# Altium project RF_Attenuator.PrjPCB (part 1 of 2)
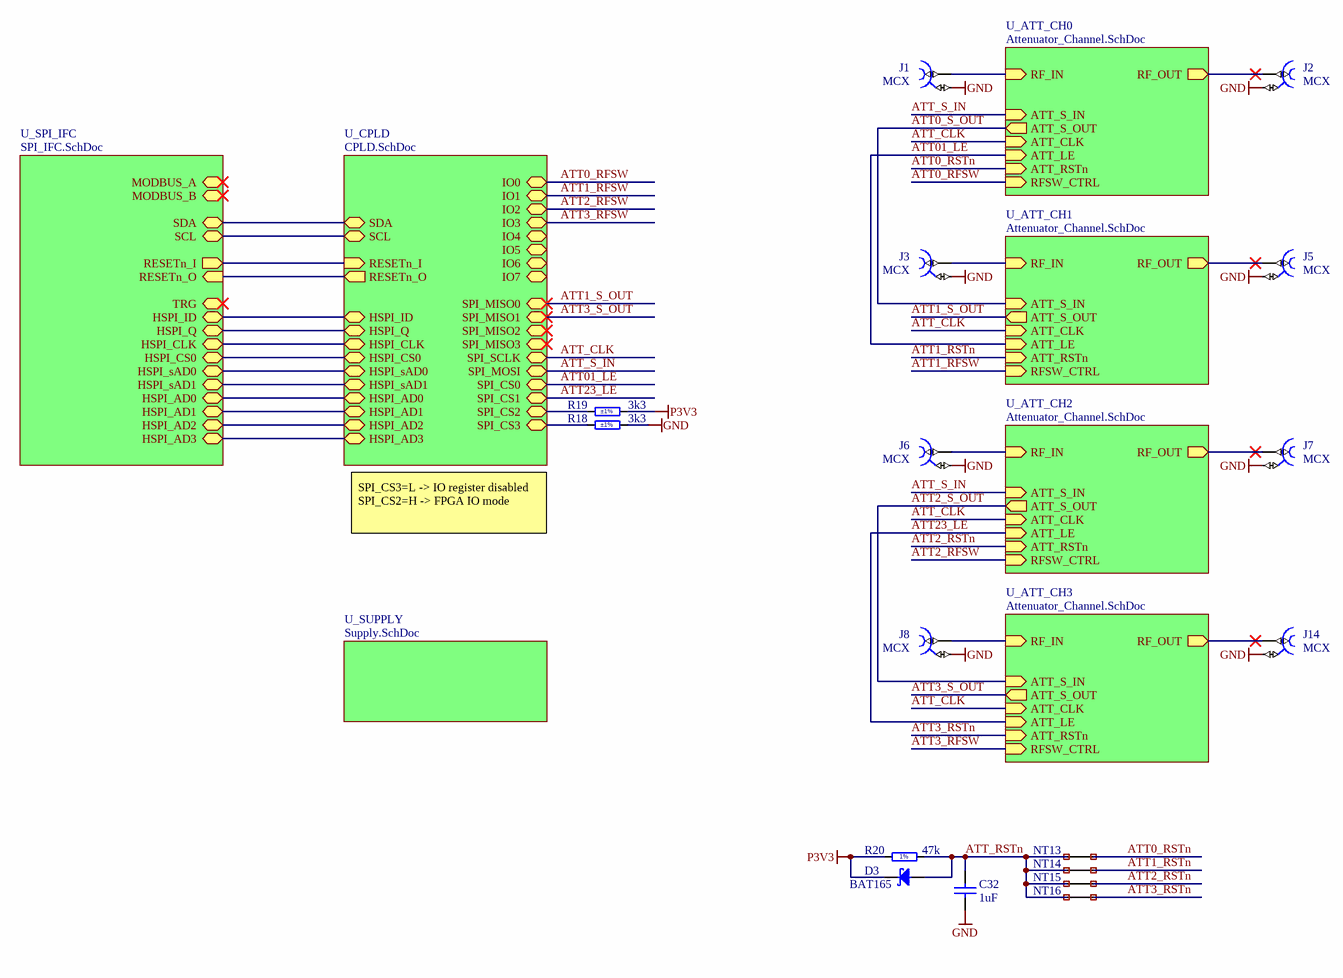
[diagram p0: RF_Attenuator.SchDoc]
ProjectRev: 1.0; ProjectName: RF Attenuator; Project: RF_attenuator_SW_4CH
5 sheets, 217 parts. Net scope: hierarchical (ports join the sheet entries above them; power ports are global).
Board file: RF_Attenuator.PCBDOC
Sheets:
  RF_Attenuator.SchDoc
    U_SPI_IFC = SPI_IFC.SchDoc
    U_ATT_CH0 = Attenuator_Channel.SchDoc
    U_ATT_CH1 = Attenuator_Channel.SchDoc
    U_ATT_CH2 = Attenuator_Channel.SchDoc
    U_ATT_CH3 = Attenuator_Channel.SchDoc
    U_SUPPLY = Supply.SchDoc
    U_CPLD = CPLD.SchDoc

## Sheet RF_Attenuator.SchDoc: =Project
size 420 x 297 mm; Author: G.Kasprowicz; CompanyName: WUT ISE; DrawnBy: G.Kasprowicz; Organization: WUT ISE; Address1: PW ISE; Address2: Nowowiejska 15/19 00-665 Warsaw; Address3: gkasprow@gmail.com; Revision: 1.0; SheetNumber: -; SheetTotal: -; ModifiedBy: -; CheckedDate: -; Title2: Top; DivGrp: WUT ISE; Designer: G.Kasprowicz; SPICEModelCacheRYPVXPCY: <root> / <DocumentId>RYPVXPCY</DocumentId> / </root>; ModifiedDate: -; ProjectName: Sensor Box

### Parts
C32  1uF  [CAPC1005X55N]
D3  BAT165  [SOD2512X110N]
J1  MCX  [AMPHENOL_919-109J-51PX]
J2  MCX  [AMPHENOL_919-109J-51PX]
J3  MCX  [AMPHENOL_919-109J-51PX]
J5  MCX  [AMPHENOL_919-109J-51PX]
J6  MCX  [AMPHENOL_919-109J-51PX]
J7  MCX  [AMPHENOL_919-109J-51PX]
J8  MCX  [AMPHENOL_919-109J-51PX]
J14  MCX  [AMPHENOL_919-109J-51PX]
NT13  Net Tie  [Net Tie 3]  (value not drawn)  (net tie, no BOM)
NT14  Net Tie  [Net Tie 3]  (value not drawn)  (net tie, no BOM)
NT15  Net Tie  [Net Tie 3]  (value not drawn)  (net tie, no BOM)
NT16  Net Tie  [Net Tie 3]  (value not drawn)  (net tie, no BOM)
R18  3k3  Tolerance: ±1%  [RESC1005X40N]
R19  3k3  Tolerance: ±1%  [RESC1005X40N]
R20  47k  [RESC1005X40N]

### Sub-sheets
U_ATT_CH0 = Attenuator_Channel.SchDoc: ATT_LE (in), RF_IN (in), RF_OUT (out), ATT_S_OUT (out), ATT_CLK (in), ATT_RSTn (in), ATT_S_IN (in), RFSW_CTRL (in)
U_ATT_CH1 = Attenuator_Channel.SchDoc: ATT_LE (in), RF_IN (in), RF_OUT (out), ATT_S_OUT (out), ATT_CLK (in), ATT_RSTn (in), ATT_S_IN (in), RFSW_CTRL (in)
U_ATT_CH2 = Attenuator_Channel.SchDoc: ATT_LE (in), RF_IN (in), RF_OUT (out), ATT_S_OUT (out), ATT_CLK (in), ATT_RSTn (in), ATT_S_IN (in), RFSW_CTRL (in)
U_ATT_CH3 = Attenuator_Channel.SchDoc: ATT_LE (in), RF_IN (in), RF_OUT (out), ATT_S_OUT (out), ATT_CLK (in), ATT_RSTn (in), ATT_S_IN (in), RFSW_CTRL (in)
U_CPLD = CPLD.SchDoc: SDA (bidir), SCL (bidir), RESETn_I (in), RESETn_O (out), HSPI_ID (bidir), HSPI_Q (bidir), HSPI_CLK (bidir), HSPI_CS0 (bidir), HSPI_sAD0 (bidir), HSPI_sAD1 (bidir), HSPI_AD0 (bidir), HSPI_AD1 (bidir), HSPI_AD2 (bidir), HSPI_AD3 (bidir), IO5 (bidir), IO0 (bidir), IO1 (bidir), SPI_MISO2 (bidir), SPI_CS3 (bidir), SPI_CS1 (bidir), SPI_SCLK (bidir), IO4 (bidir), SPI_MISO3 (bidir), IO3 (bidir), SPI_MISO0 (bidir), SPI_CS0 (bidir), SPI_MOSI (bidir), SPI_CS2 (bidir), IO2 (bidir), IO7 (bidir), SPI_MISO1 (bidir), IO6 (bidir)
U_SPI_IFC = SPI_IFC.SchDoc: TRG (bidir), SCL (bidir), RESETn_O (in), MODBUS_A (bidir), HSPI_AD3 (bidir), MODBUS_B (bidir), RESETn_I (out), SDA (bidir), HSPI_CLK (bidir), HSPI_Q (bidir), HSPI_sAD0 (bidir), HSPI_ID (bidir), HSPI_AD2 (bidir), HSPI_CS0 (bidir), HSPI_AD1 (bidir), HSPI_sAD1 (bidir), HSPI_AD0 (bidir)
U_SUPPLY = Supply.SchDoc: no entries

### Nets
GND: C32.1 J1.2 J2.2 J3.2 J5.2 J6.2 J7.2 J8.2 J14.2 R18.2
P3V3: D3.1(C) R19.2 R20.1
ATT0_RFSW: sheet U_ATT_CH0/RFSW_CTRL, sheet U_CPLD/IO0
ATT0_RSTn: NT13.2 ; sheet U_ATT_CH0/ATT_RSTn
ATT0_S_OUT: sheet U_ATT_CH0/ATT_S_OUT, sheet U_ATT_CH1/ATT_S_IN
ATT01_LE: sheet U_ATT_CH0/ATT_LE, sheet U_ATT_CH1/ATT_LE, sheet U_CPLD/SPI_CS0
ATT1_RFSW: sheet U_ATT_CH1/RFSW_CTRL, sheet U_CPLD/IO1
ATT1_RSTn: NT14.2 ; sheet U_ATT_CH1/ATT_RSTn
ATT1_S_OUT: sheet U_ATT_CH1/ATT_S_OUT, sheet U_CPLD/SPI_MISO0
ATT2_RFSW: sheet U_ATT_CH2/RFSW_CTRL, sheet U_CPLD/IO2
ATT2_RSTn: NT15.2 ; sheet U_ATT_CH2/ATT_RSTn
ATT2_S_OUT: sheet U_ATT_CH2/ATT_S_OUT, sheet U_ATT_CH3/ATT_S_IN
ATT3_RFSW: sheet U_ATT_CH3/RFSW_CTRL, sheet U_CPLD/IO3
ATT3_RSTn: NT16.2 ; sheet U_ATT_CH3/ATT_RSTn
ATT3_S_OUT: sheet U_ATT_CH3/ATT_S_OUT, sheet U_CPLD/SPI_MISO1
ATT23_LE: sheet U_ATT_CH2/ATT_LE, sheet U_ATT_CH3/ATT_LE, sheet U_CPLD/SPI_CS1
ATT_CLK: sheet U_ATT_CH0/ATT_CLK, sheet U_ATT_CH1/ATT_CLK, sheet U_ATT_CH2/ATT_CLK, sheet U_ATT_CH3/ATT_CLK, sheet U_CPLD/SPI_SCLK
ATT_RSTn: C32.2 D3.2(A) NT13.1 NT14.1 NT15.1 NT16.1 R20.2
ATT_S_IN: sheet U_ATT_CH0/ATT_S_IN, sheet U_ATT_CH2/ATT_S_IN, sheet U_CPLD/SPI_MOSI
HSPI_AD0: sheet U_SPI_IFC/HSPI_AD0, sheet U_CPLD/HSPI_AD0
HSPI_AD1: sheet U_SPI_IFC/HSPI_AD1, sheet U_CPLD/HSPI_AD1
HSPI_AD2: sheet U_SPI_IFC/HSPI_AD2, sheet U_CPLD/HSPI_AD2
HSPI_AD3: sheet U_SPI_IFC/HSPI_AD3, sheet U_CPLD/HSPI_AD3
HSPI_CLK: sheet U_SPI_IFC/HSPI_CLK, sheet U_CPLD/HSPI_CLK
HSPI_CS0: sheet U_SPI_IFC/HSPI_CS0, sheet U_CPLD/HSPI_CS0
HSPI_ID: sheet U_SPI_IFC/HSPI_ID, sheet U_CPLD/HSPI_ID
HSPI_Q: sheet U_SPI_IFC/HSPI_Q, sheet U_CPLD/HSPI_Q
HSPI_sAD0: sheet U_SPI_IFC/HSPI_sAD0, sheet U_CPLD/HSPI_sAD0
HSPI_sAD1: sheet U_SPI_IFC/HSPI_sAD1, sheet U_CPLD/HSPI_sAD1
RESETn_I: sheet U_SPI_IFC/RESETn_I, sheet U_CPLD/RESETn_I
RESETn_O: sheet U_SPI_IFC/RESETn_O, sheet U_CPLD/RESETn_O
SCL: sheet U_SPI_IFC/SCL, sheet U_CPLD/SCL
SDA: sheet U_SPI_IFC/SDA, sheet U_CPLD/SDA
SPI_CS2: R19.1 ; sheet U_CPLD/SPI_CS2
SPI_CS3: R18.1 ; sheet U_CPLD/SPI_CS3
NetC5A_2: J1.1 ; sheet U_ATT_CH0/RF_IN
NetC5B_2: J3.1 ; sheet U_ATT_CH1/RF_IN
NetC5C_2: J6.1 ; sheet U_ATT_CH2/RF_IN
NetC5D_2: J8.1 ; sheet U_ATT_CH3/RF_IN
NetD2A_2: J2.1 ; sheet U_ATT_CH0/RF_OUT
NetD2B_2: J5.1 ; sheet U_ATT_CH1/RF_OUT
NetD2C_2: J7.1 ; sheet U_ATT_CH2/RF_OUT
NetD2D_2: J14.1 ; sheet U_ATT_CH3/RF_OUT

### Notes on the sheet
- SPI_CS3=L -> IO register disabled
  SPI_CS2=H -> FPGA IO mode
- Project/Equipment
- Document
- Designer
- Drawn by
- Check.by
- Copyright WUT ISE 2018.
  This documentation describes Open Hardware and is licensed under the CERN OHL v.1.1. You may redistribute and modify this documentation under the terms of the CERN OHL v.1.1. (http://ohwr.org/CERNOHL). This documentation is distributed WITHOUT ANY EXPRESS OR IMPLIED WARRANTY, INCLUDING OF MERCHANTABILITY, SATISFACTORY QUALITY AND FITNESS FOR A PARTICULAR PURPOSE. Please see the CERN OHL v.1.1 for applicable conditions.
- Contact
- File
- Last Mod.
- Print Date
- Sheet
- Size
- A3
- of
- Rev
- (in symbol R0402_47K_1%_0.0625W_100PPM) 1%

### Library data of the parts
C32 = CC0402_1UF_16V_10%_X5R: Non-polarised capacitor; Part Description: SMD Multilayer Chip Ceramic Capacitor; Manufacturer: GENERIC; Manufacturer1 Part Number: C1005X5R1C105KT; Voltage: 16V; TC: X5R; Tolerance: ±10%; Part Number: CC0402_1UF_16V_10%_X5R; Component Kind: Standard; Component Type: Standard; Pin Count: 2; Value: 1uF; Status: Preferred; Manufacturer Part Number: CC0402_1UF_16V_10%_X5R; Case: 0402; Mounted: Yes; Socket: No; SMD: Yes; Sense: No; Manufacturer1 Example: TDK; Manufacturer1 ComponentHeight: 0.55mm; HelpURL: \\cern.ch\dfs\Applications\Altium\Datasheets\CC0402_X5R_TDK_C.pdf; Author: CERN DEM JLC; CreateDate: 25.10.2012; LatestRevisionDate: 25.10.2012
D3 = BAT165: Schottky Diode; Part Description: Medium Power AF Schottky Diode; Manufacturer: INFINEON; Voltage: 40V; Power: 750mA; PressFit: No; Bonding: No; Part Number: BAT165; Component Kind: Standard; Component Type: Standard; Device: BAT165; PackageDescription: Small Outline Diode (SOD-323), 1.70mm W X 1.25mm L X 1.10mm H body,  IPC Medium Density; Manufacturer Part Number: BAT165; Pin Count: 2; Case: SOD-323; Mounted: Yes; Socket: No; SMD: Yes; Sense: No; ComponentHeight: 1.1mm; HelpURL: \\cern.ch\dfs\Applications\Altium\Datasheets\BAT165.pdf; Author: CERN DEM JLC; CreateDate: 12.11.2014; LatestRevisionDate: 12.11.2014
J1-J3 J5-J8 J14 = AMPHENOL_919-109J-51PX: Part Description: 50 Ohms, RF Connector, MCX Straight PCB Receptacle Jack; Manufacturer Part Number: 919-109J-51PX (MCX6251B1-3GT30G-50); PressFit: No; Part Number: AMPHENOL_919-109J-51PX; Component Kind: Standard; Component Type: Standard; Pin Count: 5; Family: MCX; Mounted: Yes; Socket: No; SMD: No; Sense: No; Status: None; Manufacturer: AMPHENOL; ComponentHeight: 6.06mm; HelpURL: \\cern.ch\dfs\Applications\Altium\Datasheets\AMPHENOL_919-109J-51PX.pdf; Author: CERN DEM BC; CreateDate: 31.01.2019; LatestRevisionDate: 31.01.2019
NT13-NT16 = Net Tie 3: Part Description: Net Tie (2 Nets); Mounted: No; Part Number: Net Tie 3; Component Type: Net Tie; Pin Count: 2; Family: Net Tie; Socket: No; SMD: No; Sense: No; Status: None; ComponentHeight: 0mm; HelpURL: Undefined; Author: CERN DEM HF; CreateDate: 23.09.2024; LatestRevisionDate: 23.09.2024; PackageDescription: SMD Net Tie
R18 R19 = R0402_3K3_1%_0.0625W_100PPM: Resistor - 1%; Part Description: General Purpose Thick Film Chip Resistor; Manufacturer: GENERIC; Manufacturer1 Part Number: 232270673302L; TC: ±100ppm/°C; PressFit: No; Part Number: R0402_3K3_1%_0.0625W_100PPM; Component Kind: Standard; Component Type: Standard; Pin Count: 2; Value: 3k3; Status: Not Recommended; Power: 0.0625W; Manufacturer Part Number: R0402_3K3_1%_0.0625W_100PPM; Case: 0402; Mounted: Yes; Sense: No; Socket: No; SMD: Yes; Manufacturer1 Example: YAGEO PHYCOMP; Manufacturer1 ComponentHeight: 0.4mm; HelpURL: \\cern.ch\dfs\Applications\Altium\Datasheets\R0402_Phycomp_RC0402.pdf; Author: CERN DEM JLC; CreateDate: 03.12.2007; LatestRevisionDate: 17.10.2012
R20 = R0402_47K_1%_0.0625W_100PPM: Resistor - 1%; Part Description: General Purpose Thick Film Chip Resistor; Manufacturer: GENERIC; Manufacturer1 Part Number: 232270675103L; TC: ±100ppm/°C; PressFit: No; Part Number: R0402_47K_1%_0.0625W_100PPM; Component Kind: Standard; Component Type: Standard; Pin Count: 2; Value: 47k; Status: Not Recommended; Power: 0.0625W; Tolerance: ±1%; Manufacturer Part Number: R0402_47K_1%_0.0625W_100PPM; Case: 0402; Mounted: Yes; Sense: No; Socket: No; SMD: Yes; Manufacturer1 Example: YAGEO PHYCOMP; Manufacturer1 ComponentHeight: 0.4mm; HelpURL: \\cern.ch\dfs\Applications\Altium\Datasheets\R0402_Phycomp_RC0402.pdf; Author: CERN DEM JLC; CreateDate: 03/12/2007; LatestRevisionDate: 17/10/2012

## Sheet SPI_IFC.SchDoc: =Project
size 420 x 297 mm; Author: G.Kasprowicz; CompanyName: WUT ISE; DrawnBy: G.Kasprowicz; Organization: WUT ISE; Address1: PW ISE; Address2: Nowowiejska 15/19 00-665 Warsaw; Address3: gkasprow@gmail.com; Revision: 1.0; SheetNumber: -; SheetTotal: -; ModifiedBy: -; CheckedDate: -; Title2: SPI IFC; DivGrp: WUT ISE; Designer: G.Kasprowicz; SPICEModelCacheRYPVXPCY: <root> / <DocumentId>RYPVXPCY</DocumentId> / </root>; ModifiedDate: -; ProjectName: Sensor Box
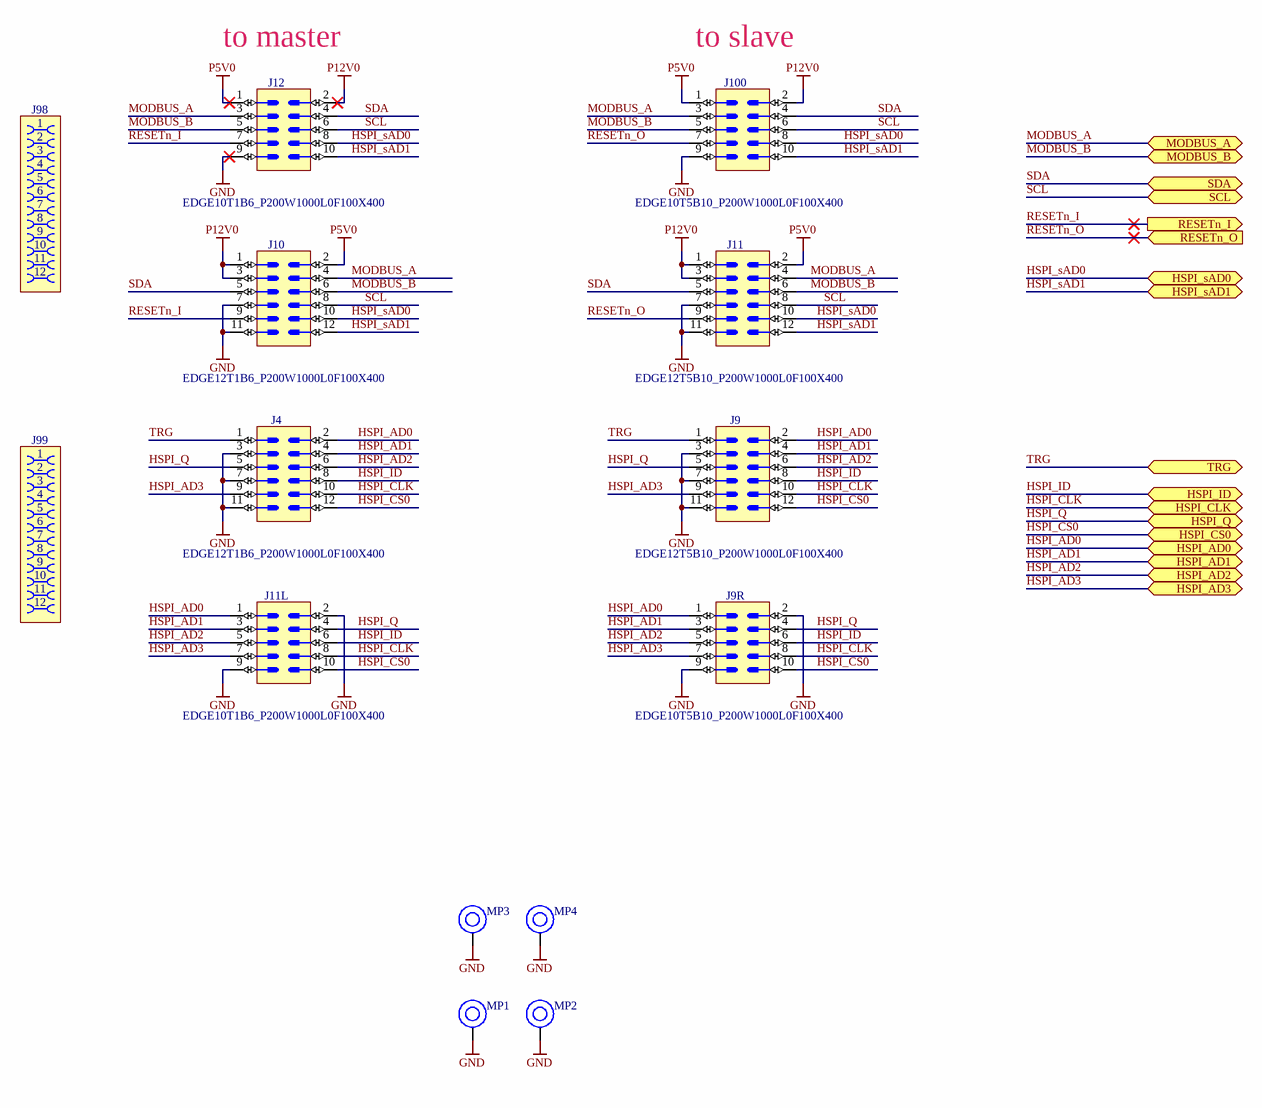
[diagram p1: SPI_IFC.SchDoc]

### Parts
J4  (no value)  [EDGE12T1B6_P200W1000L0F100X400]
J9  (no value)  [EDGE12T5B10_P200W1000L0F100X400]
J9R  (no value)  [EDGE10T5B10_P200W1000L0F100X400]
J10  (no value)  [EDGE12T1B6_P200W1000L0F100X400]
J11  (no value)  [EDGE12T5B10_P200W1000L0F100X400]
J11L  (no value)  [EDGE10T1B6_P200W1000L0F100X400]
J12  (no value)  [EDGE10T1B6_P200W1000L0F100X400]
J98  (no value)  [AVX_009159012761916]
J99  (no value)  [AVX_009159012761916]
J100  (no value)  [EDGE10T5B10_P200W1000L0F100X400]
MP1  M1.6 x 3mm  [97730306330]  (value not drawn)
MP2  M1.6 x 3mm  [97730306330]  (value not drawn)
MP3  M1.6 x 3mm  [97730306330]  (value not drawn)
MP4  M1.6 x 3mm  [97730306330]  (value not drawn)

### Ports
HSPI_AD0 (bidir), HSPI_AD1 (bidir), HSPI_AD2 (bidir), HSPI_AD3 (bidir), HSPI_CLK (bidir), HSPI_CS0 (bidir), HSPI_ID (bidir), HSPI_Q (bidir), HSPI_sAD0 (bidir), HSPI_sAD1 (bidir), MODBUS_A (bidir), MODBUS_B (bidir), RESETn_I (out), RESETn_O (in), SCL (bidir), SDA (bidir), TRG (bidir)

### Nets
GND: J4.3 J4.7 J4.11 J9.3 J9.7 J9.11 J9R.2 J9R.9 J10.7 J10.11 J11.7 J11.11 J11L.2 J11L.9 J12.9 J100.9 MP1.1 MP2.1 MP3.1 MP4.1
P5V0: J10.2 J11.2 J12.1 J100.1
P12V0: J10.1 J10.3 J11.1 J11.3 J12.2 J100.2
HSPI_AD0: J4.2 J9.2 J9R.1 J11L.1 ; port HSPI_AD0
HSPI_AD1: J4.4 J9.4 J9R.3 J11L.3 ; port HSPI_AD1
HSPI_AD2: J4.6 J9.6 J9R.5 J11L.5 ; port HSPI_AD2
HSPI_AD3: J4.9 J9.9 J9R.7 J11L.7 ; port HSPI_AD3
HSPI_CLK: J4.10 J9.10 J9R.8 J11L.8 ; port HSPI_CLK
HSPI_CS0: J4.12 J9.12 J9R.10 J11L.10 ; port HSPI_CS0
HSPI_ID: J4.8 J9.8 J9R.6 J11L.6 ; port HSPI_ID
HSPI_Q: J4.5 J9.5 J9R.4 J11L.4 ; port HSPI_Q
HSPI_sAD0: J10.10 J11.10 J12.8 J100.8 ; port HSPI_sAD0
HSPI_sAD1: J10.12 J11.12 J12.10 J100.10 ; port HSPI_sAD1
MODBUS_A: J10.4 J11.4 J12.3 J100.3 ; port MODBUS_A
MODBUS_B: J10.6 J11.6 J12.5 J100.5 ; port MODBUS_B
RESETn_I: J10.9 J12.7 ; port RESETn_I
RESETn_O: J11.9 J100.7 ; port RESETn_O
SCL: J10.8 J11.8 J12.6 J100.6 ; port SCL
SDA: J10.5 J11.5 J12.4 J100.4 ; port SDA
TRG: J4.1 J9.1 ; port TRG

### Notes on the sheet
- (near J12) to master
- (near J100) to slave
- Project/Equipment
- Document
- Designer
- Drawn by
- Check.by
- Copyright WUT ISE 2018.
  This documentation describes Open Hardware and is licensed under the CERN OHL v.1.1. You may redistribute and modify this documentation under the terms of the CERN OHL v.1.1. (http://ohwr.org/CERNOHL). This documentation is distributed WITHOUT ANY EXPRESS OR IMPLIED WARRANTY, INCLUDING OF MERCHANTABILITY, SATISFACTORY QUALITY AND FITNESS FOR A PARTICULAR PURPOSE. Please see the CERN OHL v.1.1 for applicable conditions.
- Contact
- File
- Last Mod.
- Print Date
- Sheet
- Size
- A3
- of
- Rev
- (in symbol AVX_009159012761916) 11

### Library data of the parts
J4 J10 = PCB Edge Connector 12 (2x6): Part Number: EDGE10T1B6_P200W1000L0F100X400; Part Description: 10 Contacts Board Edge Connector, Pitch 2mm, Length 0mm, Width 10mm, Finger Lenght 4mm, Finger Width 1mm; Mounted: No; PressFit: No; Component Kind: Standard (No BOM); Component Type: Standard (No BOM); Pin Count: 12; Socket: No; SMD: No; Sense: No; Status: None; ComponentHeight: 0mm; HelpURL: \\cern.ch\dfs\Applications\Altium\Datasheets\EDGE10T1B6_P200W1000L0F100X400.pdf; Author: CERN DEM MR; CreateDate: 14.02.2018; LatestRevisionDate: 14.02.2018
J9 J11 = PCB Edge Connector 12 (2x6) R: PCB Edge Connector 12 (2x6); Part Description: 12 Contacts Board Edge Connector, Pitch 2mm, Length 0mm, Width 10mm, Finger Lenght 4mm, Finger Width 1mm; Mounted: No; PressFit: No; Part Number: EDGE12T5B10_P200W1000L0F100X400; Component Kind: Standard (No BOM); Component Type: Standard (No BOM); Pin Count: 12; Socket: No; SMD: No; Sense: No; Status: None; ComponentHeight: 0mm; HelpURL: \\cern.ch\dfs\Applications\Altium\Datasheets\EDGE10T5B10_P200W1000L0F100X400.pdf; Author: GK; CreateDate: 14.02.2018; LatestRevisionDate: 14.02.2018
J9R J100 = EDGE10T5B10_P200W1000L0F100X400: PCB Edge Connector 10 (2x5); Part Description: 10 Contacts Board Edge Connector, Pitch 2mm, Length 0mm, Width 10mm, Finger Lenght 4mm, Finger Width 1mm; Mounted: No; PressFit: No; Part Number: EDGE10T5B10_P200W1000L0F100X400; Component Kind: Standard (No BOM); Component Type: Standard (No BOM); Pin Count: 10; Socket: No; SMD: No; Sense: No; Status: None; ComponentHeight: 0mm; HelpURL: \\cern.ch\dfs\Applications\Altium\Datasheets\EDGE10T5B10_P200W1000L0F100X400.pdf; Author: CERN DEM MR; CreateDate: 14.02.2018; LatestRevisionDate: 14.02.2018
J11L J12 = EDGE10T1B6_P200W1000L0F100X400: PCB Edge Connector 10 (2x5); Part Description: 10 Contacts Board Edge Connector, Pitch 2mm, Length 0mm, Width 10mm, Finger Lenght 4mm, Finger Width 1mm; Mounted: No; PressFit: No; Part Number: EDGE10T1B6_P200W1000L0F100X400; Component Kind: Standard (No BOM); Component Type: Standard (No BOM); Pin Count: 10; Socket: No; SMD: No; Sense: No; Status: None; ComponentHeight: 0mm; HelpURL: \\cern.ch\dfs\Applications\Altium\Datasheets\EDGE10T1B6_P200W1000L0F100X400.pdf; Author: CERN DEM MR; CreateDate: 14.02.2018; LatestRevisionDate: 14.02.2018
J98 J99 = AVX_009159012761916: Open Ended Card Edge Connector, 9159 Series; Part Number: AVX_0009159012761916; Part Description: 10 Contacts, 2mm Pitch, Open Ended Card Edge Connector, 9159 Series; Manufacturer: AVX; PressFit: No; Component Kind: Standard; Component Type: Standard; Pin Count: 12; Mounted: Yes; Socket: No; SMD: No; Sense: No; Status: None; Manufacturer Part Number: 009159012761916; ComponentHeight: 1.6mm; HelpURL: \\cern.ch\dfs\Applications\Altium\Datasheets\AVX_00 9159 010 061 916.pdf; Author: GK; CreateDate: 13.02.2018; LatestRevisionDate: 13.02.2018
MP1-MP4 = 97730306330R: WA-SMSI SMT Steel Spacer with internal Thread Bottom closed, OD 3.3mm, M1.6 x 3mm; Manufacturer: Wurth Elektronik; Inside Thread Length: 1.8mm; Surface: Tin; ComponentLink1Description: Website Link; ComponentLink1URL: https://www.we-online.com/redexpert/article/97730306330R?ad; ComponentLink2Description: Datasheet Link; ComponentLink2URL: https://www.we-online.com/redexpert/spec/97730306330R?ad; Manufacturer Part Number: 97730306330R; Category: SMT Spacers; Match Code: WA-SMSI; Mount: Surface Mount; Operating Temperature Max: 150°C; Operating Temperature Min: -55°C; Packaging: Tape and Reel; Height: 3mm; Material: Steel; Outside Diameter: 3.3mm; Thread Size: M1.6

## Sheet Attenuator_Channel.SchDoc: =Project
size 420 x 297 mm; Author: G.Kasprowicz; CompanyName: WUT ISE; DrawnBy: G.Kasprowicz; Organization: WUT ISE; Address1: PW ISE; Address2: Nowowiejska 15/19 00-665 Warsaw; Address3: gkasprow@gmail.com; Revision: 1.0; SheetNumber: -; SheetTotal: -; ModifiedBy: -; CheckedDate: -; Title2: Attenuator Channel; DivGrp: WUT ISE; Designer: G.Kasprowicz; SPICEModelCacheRYPVXPCY: <root> / <DocumentId>RYPVXPCY</DocumentId> / </root>; ModifiedDate: -; ProjectName: Sensor Box
Used 4 times, as channels U_ATT_CH0, U_ATT_CH1, U_ATT_CH2, U_ATT_CH3. Parts and nets are listed once, with the designators drawn on the sheet.
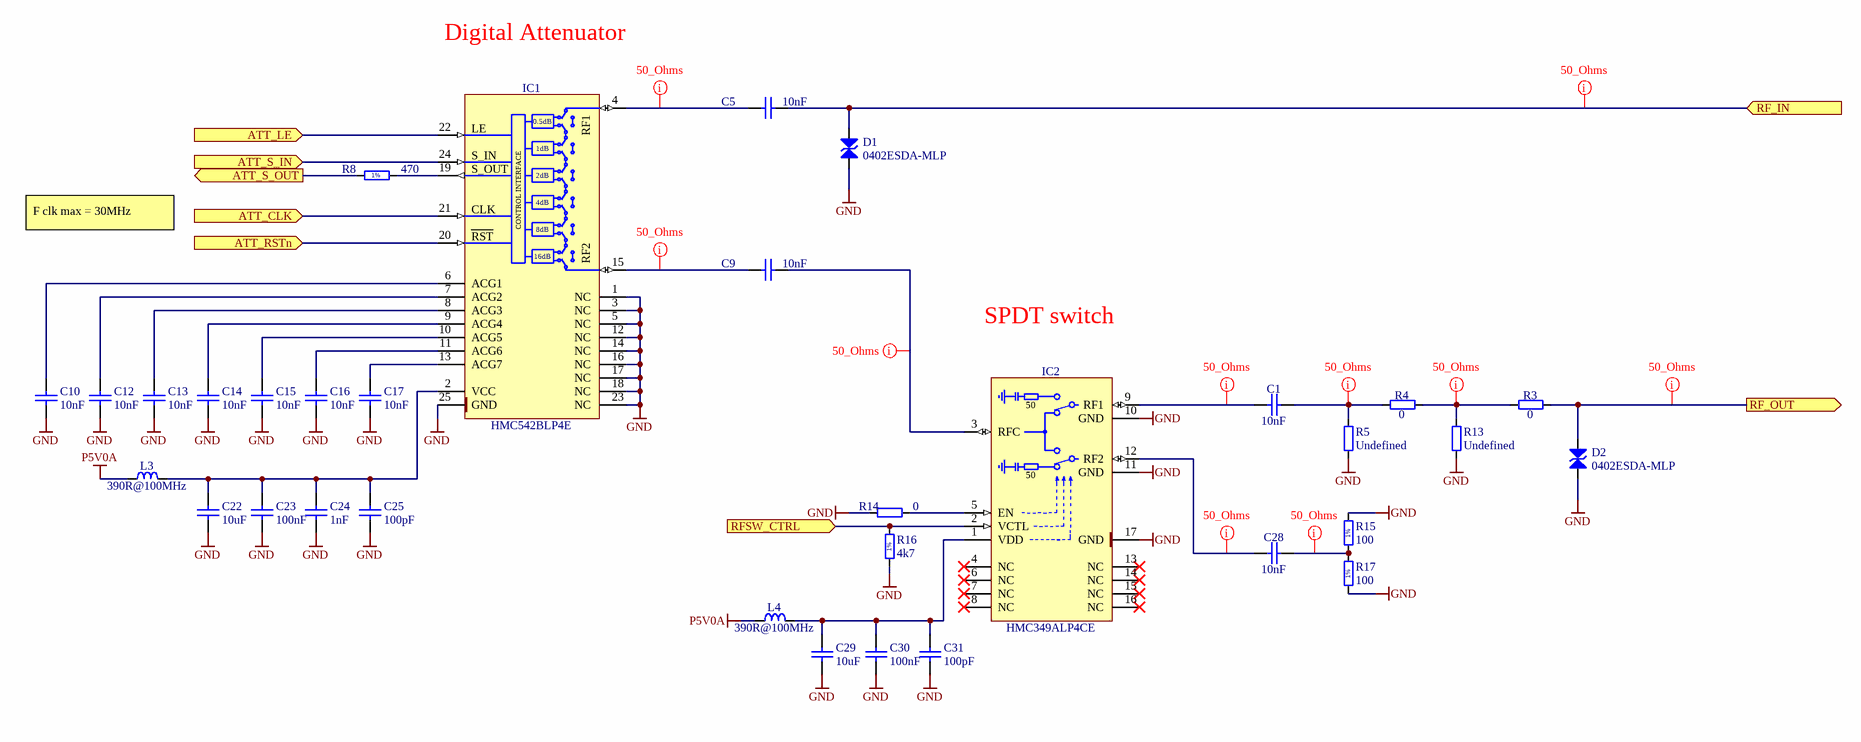
[diagram p2: Attenuator_Channel.SchDoc]

### Parts
C1  10nF  [CAPC1005X55N]
C5  10nF  [CAPC1005X55N]
C9  10nF  [CAPC1005X55N]
C10  10nF  [CAPC1005X55N]
C12  10nF  [CAPC1005X55N]
C13  10nF  [CAPC1005X55N]
C14  10nF  [CAPC1005X55N]
C15  10nF  [CAPC1005X55N]
C16  10nF  [CAPC1005X55N]
C17  10nF  [CAPC1005X55N]
C22  10uF  [CAPC1608X80N]
C23  100nF  [CAPC1005X55N]
C24  1nF  [CAPC1005X55N]
C25  100pF  [CAPC1005X55N]
C28  10nF  [CAPC1005X55N]
C29  10uF  [CAPC1608X80N]
C30  100nF  [CAPC1005X55N]
C31  100pF  [CAPC1005X55N]
D1  0402ESDA-MLP  [EATON_0402ESDA-MLP]
D2  0402ESDA-MLP  [EATON_0402ESDA-MLP]
IC1  HMC542BLP4E  [QFN50P400X400X100-25N-S295]
IC2  HMC349ALP4CE  [QFN65P400X400X100-17N-S255]
L3  390R@100MHz  [INDC1608X95N]
L4  390R@100MHz  [INDC1608X95N]
R3  0  [RESC1005X40N]
R4  0  [RESC1005X40N]
R5  Undefined  [RESC1005X40N]
R8  470  [RESC1005X40N]
R13  Undefined  [RESC1005X40N]
R14  0  [RESC1005X40N]
R15  100  [RESC1005X40N]
R16  4k7  [RESC1005X40N]
R17  100  [RESC1005X40N]

### Ports
ATT_CLK (in), ATT_LE (in), ATT_RSTn (in), ATT_S_IN (in), ATT_S_OUT (out), RF_IN (in), RF_OUT (out), RFSW_CTRL (in)

### Nets
GND: C10.1 C12.1 C13.1 C14.1 C15.1 C16.1 C17.1 C22.1 C23.1 C24.1 C25.1 C29.1 C30.1 C31.1 D1.1 D2.1 IC1.1(NC) IC1.3(NC) IC1.5(NC) IC1.12(NC) IC1.14(NC) IC1.16(NC) IC1.17(NC) IC1.18(NC) IC1.23(NC) IC1.25(GND) IC2.10(GND) IC2.11(GND) IC2.17(GND) R5.1 R13.1 R14.1 R15.2 R16.1 R17.1
P5V0A: L3.1 L4.1
ATT_CLK: IC1.21(SHIFT_CLOCK) ; port ATT_CLK
ATT_LE: IC1.22(LATCH_ENABLE) ; port ATT_LE
ATT_RSTn: IC1.20(~{RESET}) ; port ATT_RSTn
ATT_S_IN: IC1.24(SERIAL_INPUT) ; port ATT_S_IN
ATT_S_OUT: R8.1 ; port ATT_S_OUT
RF_IN: C5.2 D1.2 ; port RF_IN
RF_OUT: D2.2 R3.2 ; port RF_OUT
RFSW_CTRL: IC2.2(VCTL) R16.2 ; port RFSW_CTRL
NetC1_1: C1.1 IC2.9(RF1)
NetC1_2: C1.2 R4.1 R5.2
NetC5_1: C5.1 IC1.4(RF1)
NetC9_1: C9.1 IC1.15(RF2)
NetC9_2: C9.2 IC2.3(RFC)
NetC10_2: C10.2 IC1.6(ACG1)
NetC12_2: C12.2 IC1.7(ACG2)
NetC13_2: C13.2 IC1.8(ACG3)
NetC14_2: C14.2 IC1.9(ACG4)
NetC15_2: C15.2 IC1.10(ACG5)
NetC16_2: C16.2 IC1.11(ACG6)
NetC17_2: C17.2 IC1.13(ACG7)
NetC22_2: C22.2 C23.2 C24.2 C25.2 IC1.2(VCC) L3.2
NetC28_1: C28.1 IC2.12(RF2)
NetC28_2: C28.2 R15.1 R17.2
NetC29_2: C29.2 C30.2 C31.2 IC2.1(VDD) L4.2
NetIC1_19: IC1.19(SERIAL_OUTPUT) R8.2
NetIC2_5: IC2.5(EN) R14.2
NetR3_1: R3.1 R4.2 R13.2

Not connected (* = marked no-connect by the designer): IC2 4(NC)* 6(NC)* 7(NC)* 8(NC)* 13(NC)* 14(NC)* 15(NC)* 16(NC)*

### Channels
U_ATT_CH0: designators end in A; ports ATT_CLK=ATT_CLK ATT_LE=ATT01_LE ATT_RSTn=ATT0_RSTn ATT_S_IN=ATT_S_IN ATT_S_OUT=ATT0_S_OUT RF_IN=NetC5A_2 RF_OUT=NetD2A_2 RFSW_CTRL=ATT0_RFSW
U_ATT_CH1: designators end in B; ports ATT_CLK=ATT_CLK ATT_LE=ATT01_LE ATT_RSTn=ATT1_RSTn ATT_S_IN=ATT0_S_OUT ATT_S_OUT=ATT1_S_OUT RF_IN=NetC5B_2 RF_OUT=NetD2B_2 RFSW_CTRL=ATT1_RFSW
U_ATT_CH2: designators end in C; ports ATT_CLK=ATT_CLK ATT_LE=ATT23_LE ATT_RSTn=ATT2_RSTn ATT_S_IN=ATT_S_IN ATT_S_OUT=ATT2_S_OUT RF_IN=NetC5C_2 RF_OUT=NetD2C_2 RFSW_CTRL=ATT2_RFSW
U_ATT_CH3: designators end in D; ports ATT_CLK=ATT_CLK ATT_LE=ATT23_LE ATT_RSTn=ATT3_RSTn ATT_S_IN=ATT2_S_OUT ATT_S_OUT=ATT3_S_OUT RF_IN=NetC5D_2 RF_OUT=NetD2D_2 RFSW_CTRL=ATT3_RFSW

### Layout directives
net class 50_Ohms: NetC1A_1, NetC1A_2, NetC5A_1, NetC5A_2, NetC9A_1, NetC9A_2, NetC28A_1, NetC28A_2, NetD2A_2, NetR3A_1

### Notes on the sheet
- Digital Attenuator
- F clk max = 30MHz
- SPDT switch
- Project/Equipment
- Document
- Designer
- Drawn by
- Check.by
- Copyright WUT ISE 2018.
  This documentation describes Open Hardware and is licensed under the CERN OHL v.1.1. You may redistribute and modify this documentation under the terms of the CERN OHL v.1.1. (http://ohwr.org/CERNOHL). This documentation is distributed WITHOUT ANY EXPRESS OR IMPLIED WARRANTY, INCLUDING OF MERCHANTABILITY, SATISFACTORY QUALITY AND FITNESS FOR A PARTICULAR PURPOSE. Please see the CERN OHL v.1.1 for applicable conditions.
- Contact
- File
- Last Mod.
- Print Date
- Sheet
- Size
- A3
- of
- Rev
- (in symbol HMC349ALP4CE) 50
- (in symbol HMC542BLP4E) 0.5dB; LE; 1dB; S_IN; S_OUT; 2dB; CONTROL INTERFACE; 4dB; CLK; 8dB; RST; 16dB
- (in symbol R0402_4K7_1%_0.0625W_100PPM) 1%
- (in symbol R0402_100R_1%_0.0625W_100PPM) 1%
- (in symbol R0402_470R_1%_0.0625W_100PPM) 1%

### Library data of the parts
C1 C5 C9 C10 C12-C17 C28 = CC0402_10NF_16V_10%_X7R: Non-polarised capacitor; Part Description: SMD Multilayer Chip Ceramic Capacitor; Manufacturer: GENERIC; Manufacturer1 Part Number: 223878715636; Voltage: 16V; TC: X7R; Tolerance: ±10%; Part Number: CC0402_10NF_16V_10%_X7R; Component Kind: Standard; Component Type: Standard; Pin Count: 2; Value: 10nF; Status: Not Recommended; Manufacturer Part Number: CC0402_10NF_16V_10%_X7R; Case: 0402; Mounted: Yes; Socket: No; SMD: Yes; Sense: No; Manufacturer1 Example: PHYCOMP; Manufacturer1 ComponentHeight: 0.55mm; HelpURL: \\cern.ch\dfs\Applications\Altium\Datasheets\CC0402_X7R_PHYCOMP.pdf; Author: CERN DEM JLC; CreateDate: 2007-12-03; LatestRevisionDate: 2007-12-03
C22 C29 = CC0603_10UF_16V_20%_X5R: Non-polarised capacitor; Part Description: SMD Multilayer Chip Ceramic Capacitor; Manufacturer: GENERIC; Manufacturer1 Part Number: GRM188R61C106MA73D; Voltage: 16V; TC: X5R; Tolerance: ±20%; Part Number: CC0603_10UF_16V_20%_X5R; Component Kind: Standard; Component Type: Standard; Pin Count: 2; Value: 10uF; Status: None; Manufacturer Part Number: CC0603_10UF_16V_20%_X5R; Case: 0603; Mounted: Yes; Socket: No; SMD: Yes; Sense: No; Manufacturer1 Example: MURATA; Manufacturer1 ComponentHeight: 0.8mm; HelpURL: \\cern.ch\dfs\Applications\Altium\Datasheets\CC0603_X5R_MURATA_GRM.pdf; Author: CERN DEM MR; CreateDate: 2016-03-02; LatestRevisionDate: 2016-03-02
C23 C30 = CC0402_100NF_16V_10%_X5R: Non-polarised capacitor; Part Description: SMD Multilayer Chip Ceramic Capacitor; Manufacturer: GENERIC; Manufacturer1 Part Number: GRM155R61C104KA88D; Voltage: 16V; TC: X5R; Tolerance: ±10%; Part Number: CC0402_100NF_16V_10%_X5R; Component Kind: Standard; Component Type: Standard; Pin Count: 2; Value: 100nF; Status: None; Manufacturer Part Number: CC0402_100NF_16V_10%_X5R; Case: 0402; Mounted: Yes; Socket: No; SMD: Yes; Sense: No; Manufacturer1 Example: MURATA; Manufacturer1 ComponentHeight: 0.55mm; HelpURL: \\cern.ch\dfs\Applications\Altium\Datasheets\CC0402_X5R_MURATA_GRM.pdf; Author: CERN DEM JLC; CreateDate: 10.12.2013; LatestRevisionDate: 10.12.2013
C24 = CC0402_1NF_50V_10%_X7R: Non-polarised capacitor; Part Description: SMD Multilayer Chip Ceramic Capacitor; Manufacturer: GENERIC; Manufacturer1 Part Number: 223858715623; Voltage: 50V; TC: X7R; Tolerance: ±10%; Part Number: CC0402_1NF_50V_10%_X7R; Component Kind: Standard; Component Type: Standard; Pin Count: 2; Value: 1nF; Status: Not Recommended; Manufacturer Part Number: CC0402_1NF_50V_10%_X7R; Case: 0402; Mounted: Yes; Socket: No; SMD: Yes; Sense: No; Manufacturer1 Example: PHYCOMP; Manufacturer1 ComponentHeight: 0.55mm; HelpURL: \\cern.ch\dfs\Applications\Altium\Datasheets\CC0402_X7R_PHYCOMP.pdf; Author: CERN DEM JLC; CreateDate: 2007-12-03; LatestRevisionDate: 2007-12-03
C25 C31 = CC0402_100PF_50V_5%_C0G: Non-polarised capacitor; Part Description: SMD Multilayer Chip Ceramic Capacitor; Manufacturer: GENERIC; Manufacturer1 Part Number: C0402C101J5GACTU; Voltage: 50V; TC: C0G/NP0; Tolerance: ±5%; Part Number: CC0402_100PF_50V_5%_C0G; Component Kind: Standard; Component Type: Standard; Pin Count: 2; Value: 100pF; Status: Preferred; Manufacturer Part Number: CC0402_100PF_50V_5%_C0G; Case: 0402; Mounted: Yes; Socket: No; SMD: Yes; Sense: No; Manufacturer1 Example: KEMET; Manufacturer1 ComponentHeight: 0.55mm; HelpURL: \\cern.ch\dfs\Applications\Altium\Datasheets\CC0805_C0G_KEMET_(Commercial Grade).pdf; Author: CERN DEM JLC; CreateDate: 2007-12-03; LatestRevisionDate: 2015-04-22
D1 D2 = 0402ESDA-MLP: Transient Voltage Suppressor Diode (Bi-Directional); Part Description: 0.05pF 8kV Bidirectional ESD Voltage Suppressor; Manufacturer: EATON; Voltage: 8kV; PressFit: No; Bonding: No; Part Number: 0402ESDA-MLP; Component Kind: Standard; Component Type: Standard; Device: 0402ESDA-MLP; PackageDescription: 0402, 2-Leads, Body 1.1mm L X 0.53mm W X 0.44mm H body, IPC Medium Density; Manufacturer Part Number: 0402ESDA-MLP; Pin Count: 2; Case: 0402; Mounted: Yes; Socket: No; SMD: Yes; Sense: No; ComponentHeight: 0.44mm; HelpURL: \\cern.ch\dfs\Applications\Altium\Datasheets\0402ESDA-MLP.pdf; Author: CERN DEM MR; CreateDate: 22.11.2019; LatestRevisionDate: 22.11.2019
IC1 = HMC542BLP4E: 0.5dB LSB GaAs MMIC 6-bit Digital Serial Control Attenuator, DC - 4GHz; Part Description: 0.5dB LSB GaAs MMIC 6-bit Digital Serial Control Attenuator, DC to 4GHz; Manufacturer: HITTITE MICROWAVE CORP; PressFit: No; Bonding: No; Part Number: HMC542BLP4E; Component Kind: Standard; Component Type: Standard; Device: HMC542BLP4E; PackageDescription: QFN, 0.50mm Pitch, Square; 24 Pin, 4.00mm L X 4.00mm W X 1.00mm H Body (w/thermal Tab 2.95 X 2.95mm), IPC Medium Density; Manufacturer Part Number: HMC542BLP4E; Pin Count: 25; Case: QFN24; Mounted: Yes; Socket: No; SMD: Yes; Sense: No; ComponentHeight: 1mm; Author: CERN DEM JMW; HelpURL: \\cern.ch\dfs\Applications\Altium\Datasheets\HMC542BLP4E.pdf; CreateDate: 2016-08-17; LatestRevisionDate: 2016-08-17
IC2 = HMC349ALP4CE: DC-4GHz High Isolation SPDT Non-Reflective Switch; Manufacturer: ANALOG DEVICES; PressFit: No; Bonding: No; Part Number: HMC349ALP4CE; Component Kind: Standard; Component Type: Standard; Device: HMC349ALP4CE; PackageDescription: QFN, 0.65mm pitch,square; 4 pin X 4 pin, 4mm X 4mm X 1mm H body (w/thermal tab 2.55 X 2.55mm),  IPC Medium Density; Part Description: DC-4GHz High Isolation SPDT Non-Reflective Switch; Manufacturer Part Number: HMC349ALP4CE; Pin Count: 17; Case: QFN16; Mounted: Yes; Socket: No; SMD: Yes; Sense: No; ComponentHeight: 1mm; Author: CERN DEM JLC; HelpURL: \\cern.ch\dfs\Applications\Altium\Datasheets\HMC349ALP4CE.pdf; CreateDate: 23.02.2017; LatestRevisionDate: 23.02.2017
L3 L4 = IND0603_TDK_MPZ1608R391A: Inductor; Part Description: SMT Chip Bead for Power Line; Manufacturer: TDK; Power: 1.2A; Resistance: 0.12R; Tolerance: ±25%; Part Number: IND0603_TDK_MPZ1608R391A; Component Kind: Standard; Component Type: Standard; Pin Count: 2; Value: 390R@100MHz; Status: None; Manufacturer Part Number: MPZ1608R391A; Case: 0603; Mounted: Yes; Socket: No; SMD: Yes; Sense: No; ComponentHeight: 0.95mm; HelpURL: \\cern.ch\dfs\Applications\Altium\Datasheets\IND0603_TDK_MPZ1608.pdf; Author: CERN DEM JLC; CreateDate: 2009-12-02; LatestRevisionDate: 2009-12-02
R3 R4 R14 = R0402_0R_JUMPER: Resistor; Part Description: 1A (0.05R Max DC Resistance) Zero Ohm Jumper; Manufacturer: GENERIC; Manufacturer1 Part Number: 232270591001L; Part Number: R0402_0R_JUMPER; Component Kind: Standard; Component Type: Standard; Pin Count: 2; Value: 0; Status: Not recommended; Manufacturer Part Number: R0402_0R_JUMPER; Case: 0402; Mounted: Yes; Sense: No; Socket: No; SMD: Yes; Manufacturer1 Example: YAGEO PHYCOMP; Manufacturer1 ComponentHeight: 0.4mm; HelpURL: \\cern.ch\dfs\Applications\Altium\Datasheets\R0402_Phycomp_RC0402.pdf; Author: CERN DEM JLC; CreateDate: 2007-12-03; LatestRevisionDate: 2012-10-17
R5 R13 = R0402_NO-VALUE: Resistor; Part Description: Reserved Footprint For a 0402 (1005) Chip Resistor; Mounted: No; Part Number: R0402_NO-VALUE; Component Kind: Standard; Component Type: Standard; Pin Count: 2; Value: Undefined; Status: None; Manufacturer: Undefined; Manufacturer Part Number: R0402_NO-VALUE; Case: 0402; Sense: No; Socket: No; SMD: Yes; Manufacturer1 Example: Undefined; Manufacturer1 Part Number: Undefined; Manufacturer1 ComponentHeight: Undefined; HelpURL: Undefined; Author: CERN DEM JLC; CreateDate: 03.12.2007; LatestRevisionDate: 13.03.2008
R8 = R0402_470R_1%_0.0625W_100PPM: Resistor - 1%; Part Description: General Purpose Thick Film Chip Resistor; Manufacturer: GENERIC; Manufacturer1 Part Number: 232270674701L; TC: ±100ppm/°C; PressFit: No; Part Number: R0402_470R_1%_0.0625W_100PPM; Component Kind: Standard; Component Type: Standard; Pin Count: 2; Value: 470; Status: Not Recommended; Power: 0.0625W; Tolerance: ±1%; Manufacturer Part Number: R0402_470R_1%_0.0625W_100PPM; Case: 0402; Mounted: Yes; Sense: No; Socket: No; SMD: Yes; Manufacturer1 Example: YAGEO PHYCOMP; Manufacturer1 ComponentHeight: 0.4mm; HelpURL: \\cern.ch\dfs\Applications\Altium\Datasheets\R0402_Phycomp_RC0402.pdf; Author: CERN DEM JLC; CreateDate: 03.12.2007; LatestRevisionDate: 17.10.2012
R15 R17 = R0402_100R_1%_0.0625W_100PPM: Resistor - 1%; Part Description: General Purpose Thick Film Chip Resistor; Manufacturer: GENERIC; Manufacturer1 Part Number: 232270671001L; TC: ±100ppm/°C; PressFit: No; Part Number: R0402_100R_1%_0.0625W_100PPM; Component Kind: Standard; Component Type: Standard; Pin Count: 2; Value: 100; Status: Not Recommended; Power: 0.0625W; Tolerance: ±1%; Manufacturer Part Number: R0402_100R_1%_0.0625W_100PPM; Case: 0402; Mounted: Yes; Sense: No; Socket: No; SMD: Yes; Manufacturer1 Example: YAGEO PHYCOMP; Manufacturer1 ComponentHeight: 0.4mm; HelpURL: \\cern.ch\dfs\Applications\Altium\Datasheets\R0402_Phycomp_RC0402.pdf; Author: CERN DEM JLC; CreateDate: 03.12.2007; LatestRevisionDate: 17.10.2012
R16 = R0402_4K7_1%_0.0625W_100PPM: Resistor - 1%; Part Description: General Purpose Thick Film Chip Resistor; Manufacturer: GENERIC; Manufacturer1 Part Number: 232270674702L; TC: ±100ppm/°C; Part Number: R0402_4K7_1%_0.0625W_100PPM; Component Kind: Standard; Component Type: Standard; Pin Count: 2; Value: 4k7; Status: Not recommended; Power: 0.0625W; Tolerance: ±1%; Manufacturer Part Number: R0402_4K7_1%_0.0625W_100PPM; Case: 0402; Mounted: Yes; Sense: No; Socket: No; SMD: Yes; Manufacturer1 Example: YAGEO PHYCOMP; Manufacturer1 ComponentHeight: 0.4mm; HelpURL: \\cern.ch\dfs\Applications\Altium\Datasheets\R0402_Phycomp_RC0402.pdf; Author: CERN DEM JLC; CreateDate: 2007-12-03; LatestRevisionDate: 2012-10-17

## Sheet Supply.SchDoc: =Project
size 420 x 297 mm; Author: G.Kasprowicz; CompanyName: WUT ISE; DrawnBy: G.Kasprowicz; Organization: WUT ISE; Address1: PW ISE; Address2: Nowowiejska 15/19 00-665 Warsaw; Address3: gkasprow@gmail.com; Revision: 1.0; SheetNumber: -; SheetTotal: -; ModifiedBy: -; CheckedDate: -; Title2: Power Supply; DivGrp: WUT ISE; Designer: G.Kasprowicz; SPICEModelCacheRYPVXPCY: <root> / <DocumentId>RYPVXPCY</DocumentId> / </root>; ModifiedDate: -; ProjectName: Sensor Box
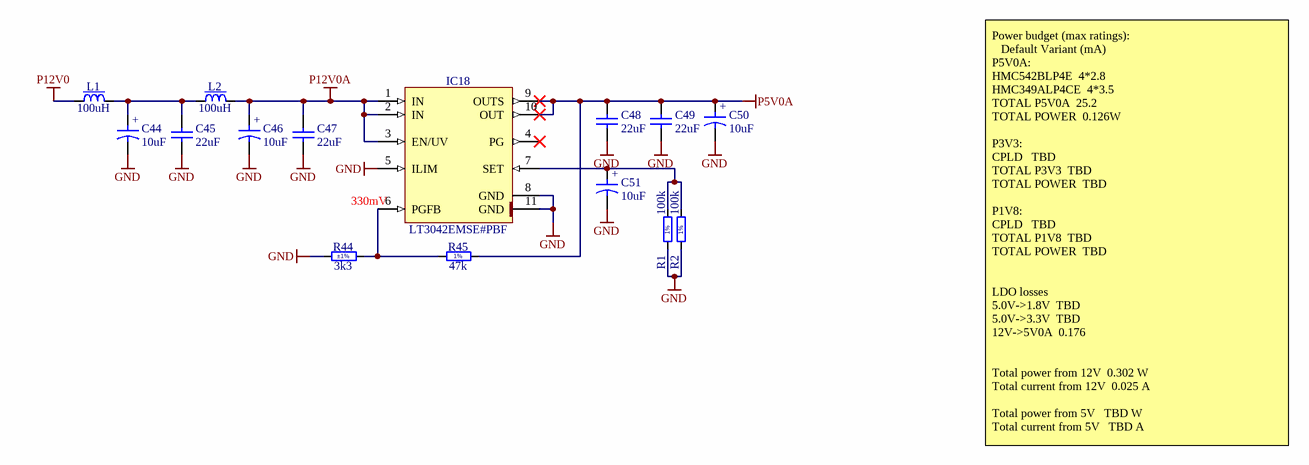
[diagram p3: Supply.SchDoc]

### Parts
C44  10uF  [CAPMP3216X180N]
C45  22uF  [CAPC2012X135N]
C46  10uF  [CAPMP3216X180N]
C47  22uF  [CAPC2012X135N]
C48  22uF  [CAPC2012X135N]
C49  22uF  [CAPC2012X135N]
C50  10uF  [CAPMP3216X180N]
C51  10uF  [CAPMP3216X180N]
IC18  LT3042EMSE#PBF  [SOP50P490X110-11N-R168X198]
L1  100uH  [INDM5650X530N]
L2  100uH  [INDM5650X530N]
R1  100k  [RESC1005X40N]
R2  100k  [RESC1005X40N]
R44  3k3  Tolerance: ±1%  [RESC1005X40N]
R45  47k  [RESC1005X40N]

### Nets
GND: C44.2 C45.1 C46.2 C47.1 C48.1 C49.1 C50.2 C51.2 IC18.5(ILIM) IC18.8(GND) IC18.11(GND) R1.2 R2.2 R44.2
P5V0A: C48.2 C49.2 C50.1 IC18.9(OUTS) IC18.10(OUT) R45.2
P12V0: L1.1
P12V0A: C46.1 C47.2 IC18.1(IN) IC18.2(IN) IC18.3(EN/UV) L2.2
NetC44_1: C44.1 C45.2 L1.2 L2.1
NetC51_1: C51.1 IC18.7(SET) R1.1 R2.1
NetIC18_6: IC18.6(PGFB) R44.1 R45.1

Not connected (* = marked no-connect by the designer): IC18 4(PG)*

### Notes on the sheet
- (near IC18) 330mV
- Power budget (max ratings):
  Default Variant (mA)
  P5V0A:
  HMC542BLP4E		4*2.8
  HMC349ALP4CE		4*3.5
  TOTAL P5V0A		25.2
  TOTAL POWER		0.126W
  P3V3:
  CPLD			TBD
  TOTAL P3V3		TBD
  TOTAL POWER		TBD
  P1V8:
  CPLD			TBD
  TOTAL P1V8		TBD
  TOTAL POWER		TBD
  LDO losses
  5.0V->1.8V		TBD
  5.0V->3.3V		TBD
  12V->5V0A		0.176
  Total power from 12V 	0.302 W
  Total current from 12V 	0.025 A
  Total power from 5V 		TBD W
  Total current from 5V 		TBD A
- Project/Equipment
- Document
- Designer
- Drawn by
- Check.by
- Copyright WUT ISE 2018.
  This documentation describes Open Hardware and is licensed under the CERN OHL v.1.1. You may redistribute and modify this documentation under the terms of the CERN OHL v.1.1. (http://ohwr.org/CERNOHL). This documentation is distributed WITHOUT ANY EXPRESS OR IMPLIED WARRANTY, INCLUDING OF MERCHANTABILITY, SATISFACTORY QUALITY AND FITNESS FOR A PARTICULAR PURPOSE. Please see the CERN OHL v.1.1 for applicable conditions.
- Contact
- File
- Last Mod.
- Print Date
- Sheet
- Size
- A3
- of
- Rev
- (in symbol CTE3216-18_10UF_16V_20%_AVX_TCJ) +
- (in symbol R0402_47K_1%_0.0625W_100PPM) 1%
- (in symbol R0402_100K_1%_0.0625W_100PPM) 1%

### Library data of the parts
C44 C46 C50 C51 = CTE3216-18_10UF_16V_20%_AVX_TCJ: Polarised capacitor; Part Description: ESR 0R200 Tantalum Solid Electrolytic Chip Capacitor with Conductive Polymer Electrode; Manufacturer: AVX; Manufacturer Part Number: TCJA106M016R0200; Voltage: 16V; Tolerance: ±20%; Part Number: CTE3216-18_10UF_16V_20%_AVX_TCJ; Component Kind: Standard; Component Type: Standard; Pin Count: 2; Value: 10uF; Status: Preferred; Case: A; Mounted: Yes; Socket: No; SMD: Yes; Sense: No; ComponentHeight: 1.8mm; HelpURL: \\cern.ch\dfs\Applications\Altium\Datasheets\CTE_AVX_TCJ.pdf; Author: CERN DEM JLC; CreateDate: 29.03.2012; LatestRevisionDate: 29.03.2012
C45 C47-C49 = CC0805_22UF_16V_10%_X5R: Non-polarised capacitor; Part Description: SMD Multilayer Chip Ceramic Capacitor; Manufacturer: GENERIC; Manufacturer1 Part Number: C2012X5R1C226KT; Voltage: 16V; TC: X5R; Tolerance: ±10%; Part Number: CC0805_22UF_16V_10%_X5R; Component Kind: Standard; Component Type: Standard; Pin Count: 2; Value: 22uF; Status: Preferred; Manufacturer Part Number: CC0805_22UF_16V_10%_X5R; Case: 0805; Mounted: Yes; Socket: No; SMD: Yes; Sense: No; Manufacturer1 Example: TDK; Manufacturer1 ComponentHeight: 1.35mm; HelpURL: \\cern.ch\dfs\Applications\Altium\Datasheets\CC0805_X5R_TDK_C.pdf; Author: CERN DEM JLC; CreateDate: 25.10.2012; LatestRevisionDate: 25.10.2012
IC18 = LT3042EMSE#PBF: 20V, 200mA, Ultralow Noise, Ultrahigh PSRR RF Linear Regulator; Manufacturer: LINEAR TECHNOLOGY; PressFit: No; Bonding: No; Part Number: LT3042EMSE#PBF; Component Kind: Standard; Component Type: Standard; Device: LT3042EMSE#PBF; PackageDescription: SOP, 0.50mm, Pitch; 10 pin, 3.00mm W X 3.00mm L X 1.10mm H body (w/thermal tab  1.68 X 1.98 mm), IPC Medium Density; Part Description: 20V, 200mA, Ultralow Noise, Ultrahigh PSRR RF Linear Regulator; Manufacturer Part Number: LT3042EMSE#PBF; Pin Count: 11; Case: MSOP10; Mounted: Yes; Socket: No; SMD: Yes; Sense: No; ComponentHeight: 1.1mm; HelpURL: \\cern.ch\dfs\Applications\Altium\Datasheets\LT3042EMSE#PBF.pdf; Author: CERN DEM MR; CreateDate: 09.06.2016; LatestRevisionDate: 09.06.2016
L1 L2 = IND2220_100UH_10%_EPCOS_B82442H: Inductor With Core; Part Description: SMT Inductor SIMID Series; Manufacturer: EPCOS; Manufacturer Part Number: B82442H1104K000; Power: 350mA; Resistance: 1.28R; Tolerance: ±10%; Part Number: IND2220_100UH_10%_EPCOS_B82442H; Component Kind: Standard; Component Type: Standard; Pin Count: 2; Value: 100uH; Case: 2220; Mounted: Yes; Socket: No; SMD: Yes; Sense: No; ComponentHeight: 5.3mm; HelpURL: \\cern.ch\dfs\Applications\Altium\Datasheets\IND2220_EPCOS_B82442H.pdf; Author: CERN DEM JLC; CreateDate: 03.10.2011; LatestRevisionDate: 03.10.2011
R1 R2 = R0402_100K_1%_0.0625W_100PPM: Resistor - 1%; Part Description: General Purpose Thick Film Chip Resistor; Manufacturer: GENERIC; Manufacturer1 Part Number: 232270671004L; PressFit: No; TC: ±100ppm/°C; Part Number: R0402_100K_1%_0.0625W_100PPM; Component Kind: Standard; Component Type: Standard; Pin Count: 2; Value: 100k; Status: Not Recommended; Manufacturer Part Number: R0402_100K_1%_0.0625W_100PPM; Case: 0402; Mounted: Yes; Sense: No; Socket: No; SMD: Yes; Manufacturer1 Example: YAGEO PHYCOMP; Manufacturer1 ComponentHeight: 0.4mm; HelpURL: \\cern.ch\dfs\Applications\Altium\Datasheets\R0402_Phycomp_RC0402.pdf; Author: CERN DEM JLC; CreateDate: 03.12.2007; LatestRevisionDate: 17.10.2012; Power: 0.0625W; Tolerance: ±1%
R44 = R0402_3K3_1%_0.0625W_100PPM: as R18 on sheet RF_Attenuator; Part Number: R0402_3K3_1%_0.0625W_100PPM; Component Kind: Standard; Component Type: Standard; Pin Count: 2; Value: 3k3; Status: Not Recommended; Power: 0.0625W; Manufacturer Part Number: R0402_3K3_1%_0.0625W_100PPM; Case: 0402; Mounted: Yes; Sense: No; Socket: No; SMD: Yes; Manufacturer1 Example: YAGEO PHYCOMP; Manufacturer1 ComponentHeight: 0.4mm; HelpURL: \\cern.ch\dfs\Applications\Altium\Datasheets\R0402_Phycomp_RC0402.pdf; Author: CERN DEM JLC; CreateDate: 03.12.2007; LatestRevisionDate: 17.10.2012
R45 = R0402_47K_1%_0.0625W_100PPM: as R20 on sheet RF_Attenuator; Part Number: R0402_47K_1%_0.0625W_100PPM; Component Kind: Standard; Component Type: Standard; Pin Count: 2; Value: 47k; Status: Not Recommended; Power: 0.0625W; Tolerance: ±1%; Manufacturer Part Number: R0402_47K_1%_0.0625W_100PPM; Case: 0402; Mounted: Yes; Sense: No; Socket: No; SMD: Yes; Manufacturer1 Example: YAGEO PHYCOMP; Manufacturer1 ComponentHeight: 0.4mm; HelpURL: \\cern.ch\dfs\Applications\Altium\Datasheets\R0402_Phycomp_RC0402.pdf; Author: CERN DEM JLC; CreateDate: 03/12/2007; LatestRevisionDate: 17/10/2012